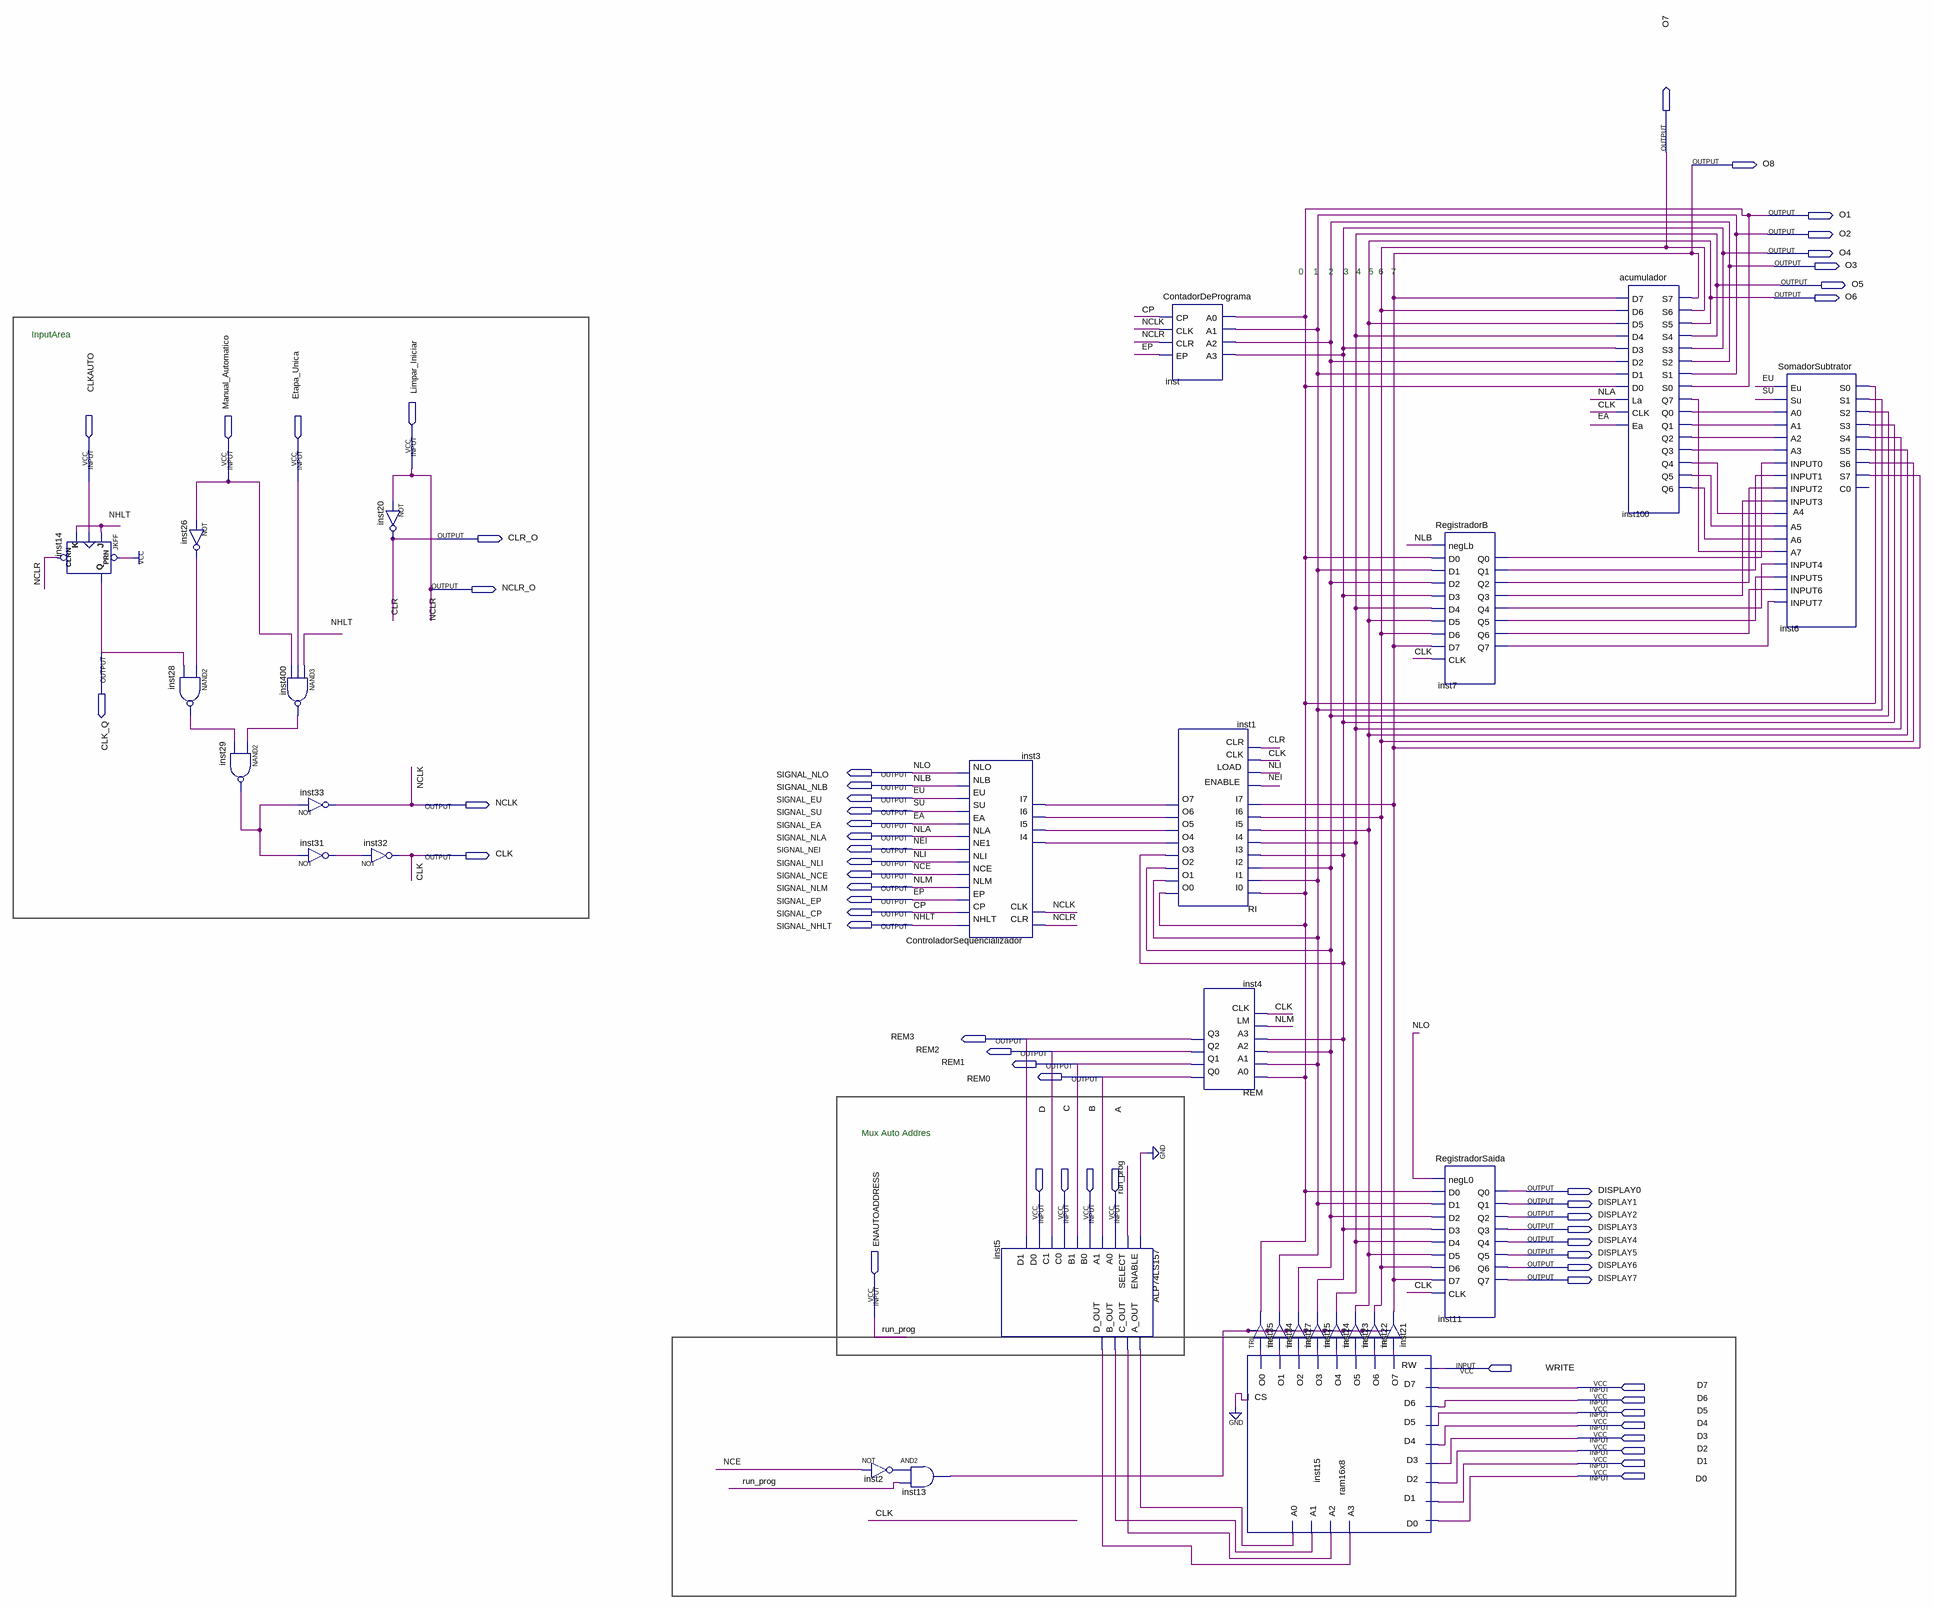
[diagram p0: schematic sheet]
// Quartus schematic SAP1.bdf as structural Verilog: 29 symbols, 56 pins
module SAP1 (
  input  Limpar_Iniciar,
  input  CLKAUTO,
  input  Manual_Automatico,
  input  Etapa_Unica,
  input  D,
  input  C,
  input  B,
  input  A,
  input  ENAUTOADDRESS,
  input  WRITE,
  input  D7,
  input  D6,
  input  D5,
  input  D4,
  input  D3,
  input  D2,
  input  D1,
  input  D0,
  output O7,
  output O8,
  output O1,
  output O2,
  output O4,
  output O3,
  output O5,
  output O6,
  output CLR_O,
  output NCLR_O,
  output CLK_Q,
  output SIGNAL_NLO,
  output SIGNAL_NLB,
  output SIGNAL_EU,
  output NCLK,
  output SIGNAL_SU,
  output SIGNAL_EA,
  output SIGNAL_NLA,
  output SIGNAL_NEI,
  output CLK,
  output SIGNAL_NLI,
  output SIGNAL_NCE,
  output SIGNAL_NLM,
  output SIGNAL_EP,
  output SIGNAL_CP,
  output SIGNAL_NHLT,
  output REM3,
  output REM2,
  output REM1,
  output REM0,
  output DISPLAY0,
  output DISPLAY1,
  output DISPLAY2,
  output DISPLAY3,
  output DISPLAY4,
  output DISPLAY5,
  output DISPLAY6,
  output DISPLAY7
);

  wire inst1_o4, inst1_o5, inst1_o6, inst1_o7, inst2_out, inst5_a_out, inst5_b_out, inst5_c_out, inst5_d_out,
       inst7_q0, inst7_q1, inst7_q2, inst7_q3, inst7_q4, inst7_q5, inst7_q6, inst7_q7, inst13_out, inst15_o0,
       inst15_o1, inst15_o2, inst15_o3, inst15_o4, inst15_o5, inst15_o6, inst15_o7, inst26_out, inst28_out,
       inst29_out, inst31_out, inst100_q0, inst100_q1, inst100_q2, inst100_q3, inst100_q4, inst100_q5,
       inst100_q6, inst100_q7, inst400_out;

  JKFF inst14 (.PRN(1'b1), .CLRN(Limpar_Iniciar), .K(SIGNAL_NHLT), .J(SIGNAL_NHLT), .CLK(CLKAUTO), .Q(CLK_Q));
  not inst26 (inst26_out, Manual_Automatico);
  nand inst28 (inst28_out, inst26_out, CLK_Q);
  nand inst29 (inst29_out, inst400_out, inst28_out);
  nand inst400 (inst400_out, SIGNAL_NHLT, Etapa_Unica, Manual_Automatico);
  not inst33 (NCLK, inst29_out);
  not inst31 (inst31_out, inst29_out);
  not inst20 (CLR_O, Limpar_Iniciar);
  not inst32 (CLK, inst31_out);
  not inst2 (inst2_out, SIGNAL_NCE);
  and inst13 (inst13_out, inst2_out, ENAUTOADDRESS);
  ControladorSequencializador inst3 (
    .CLR(Limpar_Iniciar), .I7(inst1_o7), .I6(inst1_o6), .I5(inst1_o5), .I4(inst1_o4), .CLK(NCLK),
    .NHLT(SIGNAL_NHLT), .CP(SIGNAL_CP), .EP(SIGNAL_EP), .NLM(SIGNAL_NLM), .NCE(SIGNAL_NCE), .NLI(SIGNAL_NLI),
    .NE1(SIGNAL_NEI), .NLA(SIGNAL_NLA), .EA(SIGNAL_EA), .SU(SIGNAL_SU), .EU(SIGNAL_EU), .NLB(SIGNAL_NLB),
    .NLO(SIGNAL_NLO));
  ALP74LS157 inst5 (
    .ENABLE(1'b0), .SELECT(ENAUTOADDRESS), .A0(A), .A1(REM0), .B0(B), .B1(REM1), .C0(C), .C1(REM2), .D0(D),
    .D1(REM3), .A_OUT(inst5_a_out), .C_OUT(inst5_c_out), .B_OUT(inst5_b_out), .D_OUT(inst5_d_out));
  ContadorDePrograma inst (
    .CP(SIGNAL_CP), .CLK(NCLK), .CLR(Limpar_Iniciar), .EP(SIGNAL_EP), .A0(O1), .A1(O2), .A2(O3), .A3(O4));
  RI inst1 (
    .I0(O1), .I1(O2), .I2(O3), .I3(O4), .LOAD(SIGNAL_NLI), .ENABLE(SIGNAL_NEI), .I4(O5), .I5(O6), .I6(O7),
    .I7(O8), .CLK(CLK), .CLR(CLR_O), .O0(O1), .O1(O2), .O2(O3), .O3(O4), .O4(inst1_o4), .O5(inst1_o5),
    .O6(inst1_o6), .O7(inst1_o7));
  REM inst4 (
    .A0(O1), .A1(O2), .A2(O3), .A3(O4), .LM(SIGNAL_NLM), .CLK(CLK), .Q0(REM0), .Q1(REM1), .Q2(REM2), .Q3(REM3));
  TRI inst35 (.IN(inst15_o0), .OE(inst13_out), .OUT(O1));
  ram16x8 inst15 (
    .A0(inst5_a_out), .A1(inst5_b_out), .A2(inst5_c_out), .A3(inst5_d_out), .RW(WRITE), .D6(D6), .D5(D5),
    .D3(D3), .D1(D1), .D0(D0), .D7(D7), .D4(D4), .D2(D2), .CS(1'b0), .O7(inst15_o7), .O6(inst15_o6),
    .O5(inst15_o5), .O3(inst15_o3), .O1(inst15_o1), .O0(inst15_o0), .O4(inst15_o4), .O2(inst15_o2));
  TRI inst27 (.IN(inst15_o2), .OE(inst13_out), .OUT(O3));
  TRI inst34 (.IN(inst15_o1), .OE(inst13_out), .OUT(O2));
  TRI inst23 (.IN(inst15_o5), .OE(inst13_out), .OUT(O6));
  TRI inst24 (.IN(inst15_o4), .OE(inst13_out), .OUT(O5));
  TRI inst25 (.IN(inst15_o3), .OE(inst13_out), .OUT(O4));
  TRI inst21 (.IN(inst15_o7), .OE(inst13_out), .OUT(O8));
  TRI inst22 (.IN(inst15_o6), .OE(inst13_out), .OUT(O7));
  RegistradorB inst7 (
    .negLb(SIGNAL_NLB), .D0(O1), .D1(O2), .D2(O3), .D3(O4), .D4(O5), .D5(O6), .D6(O7), .D7(O8), .CLK(CLK),
    .Q0(inst7_q0), .Q1(inst7_q1), .Q2(inst7_q2), .Q3(inst7_q3), .Q4(inst7_q4), .Q5(inst7_q5), .Q6(inst7_q6),
    .Q7(inst7_q7));
  RegistradorSaida inst11 (
    .negL0(SIGNAL_NLO), .D0(O1), .D1(O2), .D2(O3), .D3(O4), .D4(O5), .D5(O6), .D6(O7), .D7(O8), .CLK(CLK),
    .Q0(DISPLAY0), .Q1(DISPLAY1), .Q2(DISPLAY2), .Q3(DISPLAY3), .Q4(DISPLAY4), .Q5(DISPLAY5), .Q6(DISPLAY6),
    .Q7(DISPLAY7));
  acumulador inst100 (
    .D7(O8), .D6(O7), .D5(O6), .D4(O5), .D3(O4), .D2(O3), .D1(O2), .D0(O1), .La(SIGNAL_NLA), .CLK(CLK),
    .Ea(SIGNAL_EA), .S7(O8), .S6(O7), .S5(O6), .S4(O5), .S3(O4), .S2(O3), .S1(O2), .S0(O1), .Q7(inst100_q7),
    .Q0(inst100_q0), .Q1(inst100_q1), .Q2(inst100_q2), .Q3(inst100_q3), .Q4(inst100_q4), .Q5(inst100_q5),
    .Q6(inst100_q6));
  SomadorSubtrator inst6 (
    .Eu(SIGNAL_EU), .Su(SIGNAL_SU), .A0(inst100_q0), .A1(inst100_q1), .A2(inst100_q2), .A3(inst100_q3),
    .INPUT0(inst7_q0), .INPUT1(inst7_q1), .INPUT2(inst7_q2), .A4(inst100_q4), .INPUT3(inst7_q3),
    .A5(inst100_q5), .A6(inst100_q6), .A7(inst100_q7), .INPUT4(inst7_q4), .INPUT5(inst7_q5),
    .INPUT6(inst7_q6), .INPUT7(inst7_q7), .S0(O1), .S1(O2), .S2(O3), .S3(O4), .S4(O5), .S5(O6), .S6(O7),
    .S7(O8));  // open: C0

  assign NCLR_O = Limpar_Iniciar;

  // Other names for the same wires on the sheet: CLR = CLR_O; CP = SIGNAL_CP; EA = SIGNAL_EA;
  //   run_prog = ENAUTOADDRESS; EP = SIGNAL_EP; EU = SIGNAL_EU; NCLR = Limpar_Iniciar; NCE = SIGNAL_NCE;
  //   NEI = SIGNAL_NEI; NHLT = SIGNAL_NHLT; NLA = SIGNAL_NLA; NLB = SIGNAL_NLB; NLI = SIGNAL_NLI; NLM = SIGNAL_NLM;
  //   NLO = SIGNAL_NLO; SU = SIGNAL_SU

  // Notes on the sheet:
  //   0    1    2    3   4   5  6   7
  //   InputArea
  //   Mux Auto Addres
endmodule
